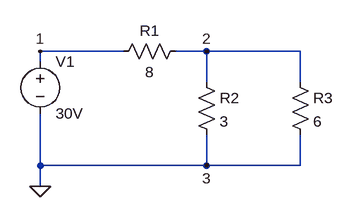
[diagram p0: schematic Draft1.asc]
Draft1.asc, the LTspice schematic file:
Version 4.1
SHEET 1 880 680
WIRE 16 64 -112 64
WIRE 144 64 96 64
WIRE 288 64 144 64
WIRE -112 80 -112 64
WIRE 144 112 144 64
WIRE 288 112 288 64
WIRE -112 240 -112 160
WIRE 144 240 144 192
WIRE 144 240 -112 240
WIRE 288 240 288 192
WIRE 288 240 144 240
WIRE -112 272 -112 240
FLAG -112 272 0
FLAG -112 64 1
FLAG 144 64 2
FLAG 144 240 3
DATAFLAG -96 64 ""
DATAFLAG 160 64 ""
DATAFLAG 128 240 ""
SYMBOL voltage -112 64 R0
WINDOW 123 0 0 Left 0
WINDOW 39 0 0 Left 0
SYMATTR InstName V1
SYMATTR Value 30V
SYMBOL res 112 48 R90
WINDOW 0 0 56 VBottom 2
WINDOW 3 32 56 VTop 2
SYMATTR InstName R1
SYMATTR Value 8
SYMBOL res 128 96 R0
SYMATTR InstName R2
SYMATTR Value 3
SYMBOL res 272 96 R0
SYMATTR InstName R3
SYMATTR Value 6

The netlist it stands for:
* Draft1.asc
V1 1 0 30V
R1 2 1 8
R2 2 0 3
R3 2 0 6
.backanno
.end